# EAGLE design AudioMega v102 (EAGLE 6.2)
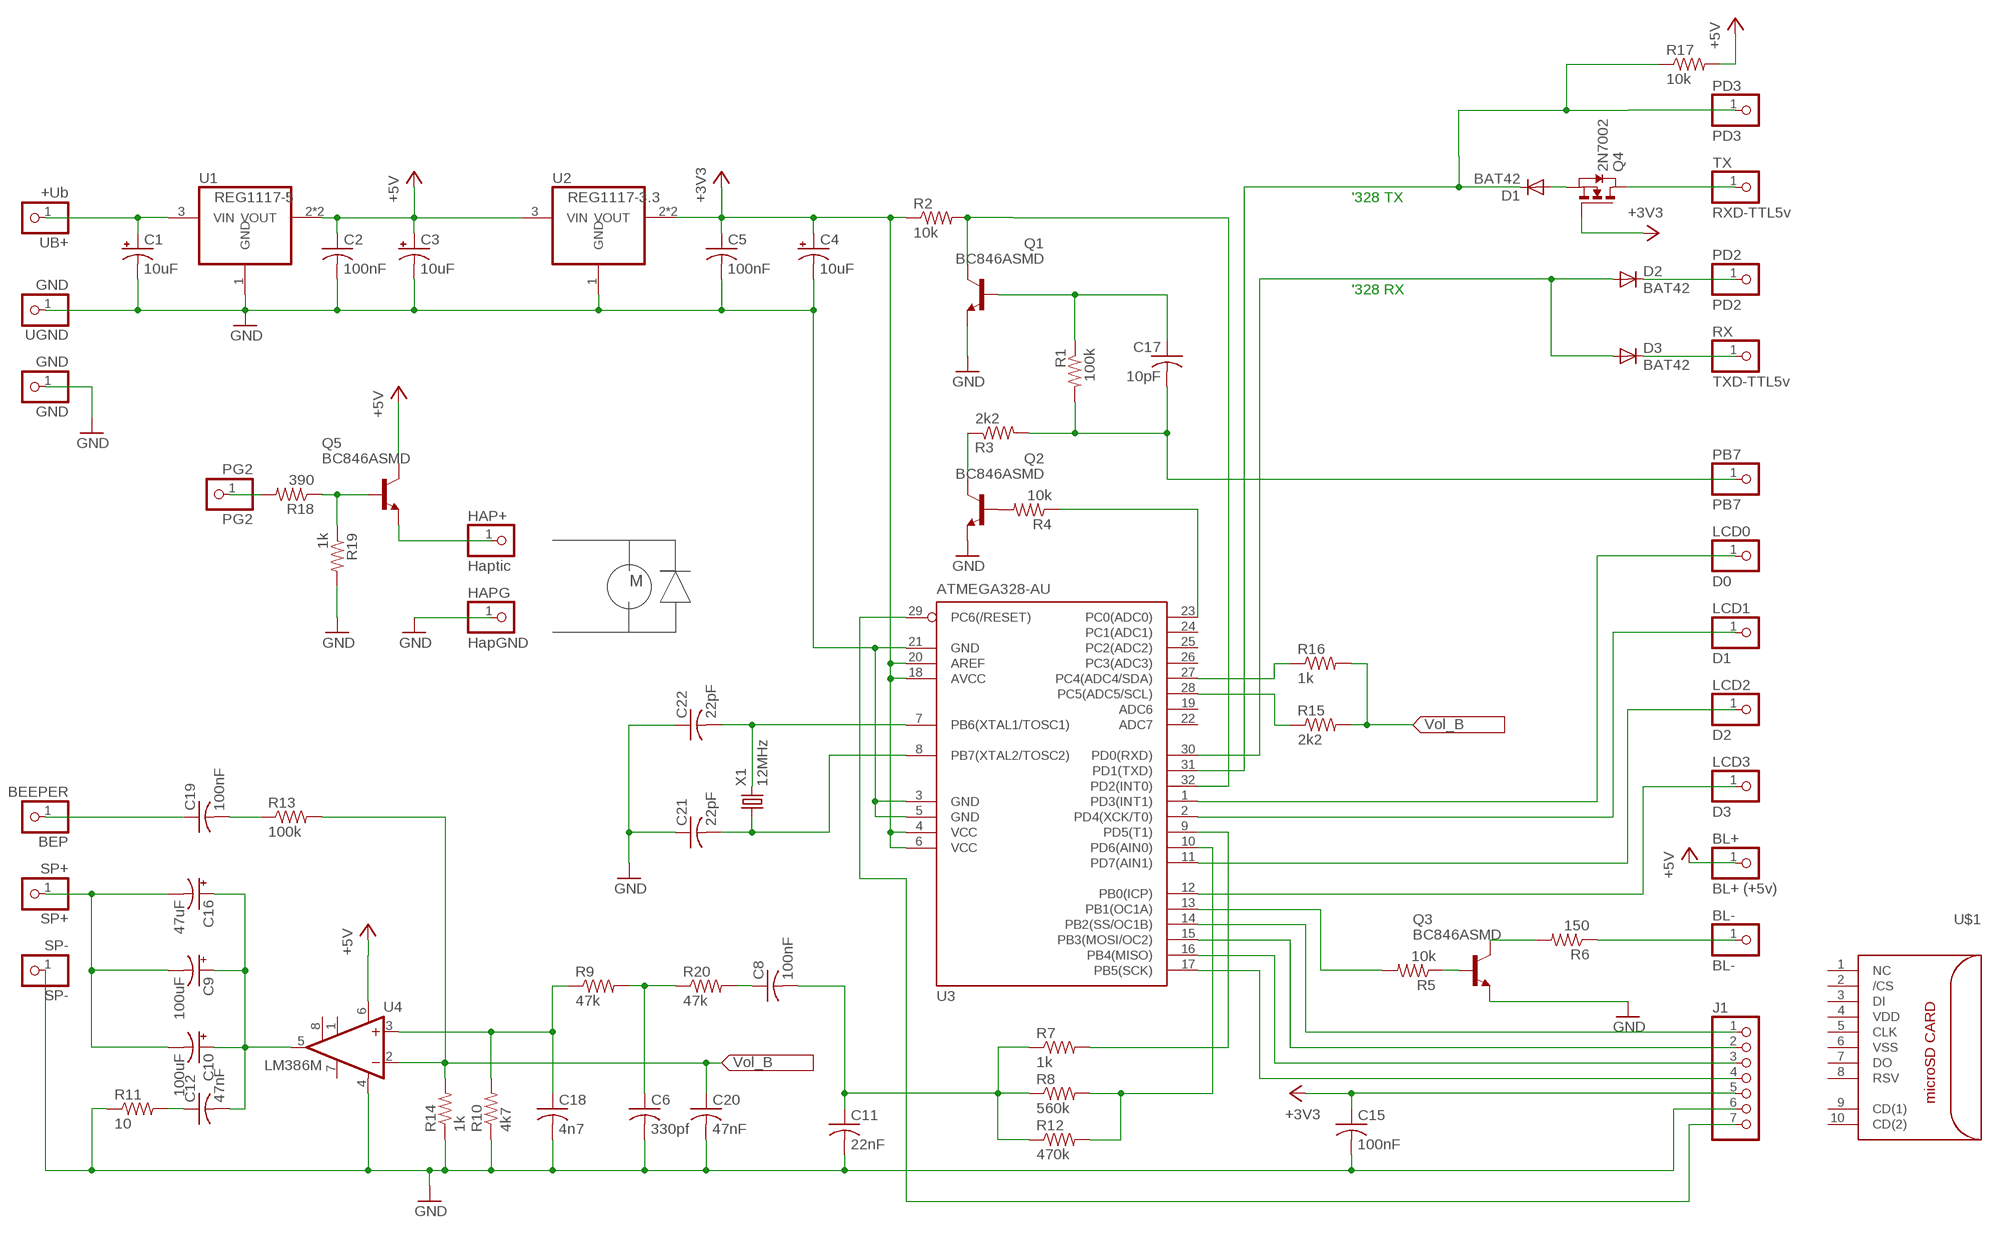
[diagram p0: schematic, sheet 1]

## Parts
BEP  BEEPER  PINHD-1X1  [1X01]
BL+  BL+ (+5v)  PINHD-1X1  [1X01]
BL-  BL-  PINHD-1X1  [1X01]
C1  10uF  CPOL-USCT3528  [CT3528]
C2  100nF  C-USC1206  [C1206]
C3  10uF  CPOL-USCT3528  [CT3528]
C4  10uF  CPOL-USCT3528  [CT3528]
C5  100nF  C-USC1206  [C1206]
C6  330pf  C-USC1206  [C1206]
C8  100nF  C-USC1206  [C1206]
C9  100uF  CPOL-USCT6032  [CT6032]
C10  100uF  CPOL-USCT6032  [CT6032]
C11  22nF  C-USC1206  [C1206]
C12  47nF  C-USC1206  [C1206]
C15  100nF  C-USC1206  [C1206]
C16  47uF  CPOL-USCT6032  [CT6032]
C17  10pF  C-USC1206  [C1206]
C18  4n7  C-USC1206  [C1206]
C19  100nF  C-USC1206  [C1206]
C20  47nF  C-USC1206  [C1206]
C21  22pF  C-USC1206  [C1206]
C22  22pF  C-USC1206  [C1206]
D1  BAT42  DIODE-SOD123  [SOD123]
D2  BAT42  DIODE-SOD123  [SOD123]
D3  BAT42  DIODE-SOD123  [SOD123]
GND  GND  PINHD-1X1  [1X01]
HAP+  Haptic  PINHD-1X1  [1X01]
HAPG  HapGND  PINHD-1X1  [1X01]
J1  PINHD-1X7  [1X07]
LCD0  D0  PINHD-1X1  [1X01]
LCD1  D1  PINHD-1X1  [1X01]
LCD2  D2  PINHD-1X1  [1X01]
LCD3  D3  PINHD-1X1  [1X01]
PB7  PB7  PINHD-1X1  [1X01]
PD2  PD2  PINHD-1X1  [1X01]
PD3  PD3  PINHD-1X1  [1X01]
PG2  PG2  PINHD-1X1  [1X01]
Q1  BC846ASMD  [SOT23]
Q2  BC846ASMD  [SOT23]
Q3  BC846ASMD  [SOT23]
Q4  2N7002  NMOSSOT23  [SOT-23]
Q5  BC846ASMD  [SOT23]
R1  100k  R-US_R1206  [R1206]
R2  10k  R-US_R1206  [R1206]
R3  2k2  R-US_R1206  [R1206]
R4  10k  R-US_R1206  [R1206]
R5  10k  R-US_R1206  [R1206]
R6  150  R-US_R1206  [R1206]
R7  1k  R-US_R1206  [R1206]
R8  560k  R-US_R1206  [R1206]
R9  47k  R-US_R1206  [R1206]
R10  4k7  R-US_R1206  [R1206]
R11  10  R-US_R1206  [R1206]
R12  470k  R-US_R1206  [R1206]
R13  100k  R-US_R1206  [R1206]
R14  1k  R-US_R1206  [R1206]
R15  2k2  R-US_R1206  [R1206]
R16  1k  R-US_R1206  [R1206]
R17  10k  R-US_R1206  [R1206]
R18  390  R-US_R1206  [R1206]
R19  1k  R-US_R1206  [R1206]
R20  47k  R-US_R1206  [R1206]
RX  TXD-TTL5v  PINHD-1X1  [1X01]
SP+  SP+  PINHD-1X1  [1X01]
SP-  SP-  PINHD-1X1  [1X01]
TX  RXD-TTL5v  PINHD-1X1  [1X01]
U1  REG1117-5  REG1117  [SOT223]
U2  REG1117-3.3  REG1117  [SOT223]
U3  ATMEGA328-AU  MEGA8-AI  [TQFP32-08]
U4  LM386M  LM386M-1  [SO08]
U$1  MICROSD_SPI_MODE  [MICRO_SD_CONNECTOR]
UB+  +Ub  PINHD-1X1  [1X01]
UGND  GND  PINHD-1X1  [1X01]
X1  12MHz  CRYSTALHC49UP  [HC49UP]

## Nets
+5V: BL+.1 C2.1 C3.+ Q5.3(C) R17.2 U1.2(VOUT) U1.4(VOUT) U2.3(VIN) U4.6(VS)
B7: C17.2 PB7.1 R1.2 R3.2
CLK: Q1.3(C) R2.2 U3.32(PD2(INT0))
GND: C1.- C2.2 C3.- C4.- C5.2 C6.2 C11.2 C15.2 C18.2 C20.2 C21.1 C22.1 GND.1 HAPG.1 J1.6 Q1.2(E) Q2.2(E) Q3.2(E) R10.1 R11.1 R14.1 R19.2 SP-.1 U1.1(GND) U2.1(GND) U3.3(GND) U3.5(GND) U3.21(GND) U4.4(GND) UGND.1
N$1: R4.1 U3.23(PC0(ADC0))
N$2: HAP+.1 Q5.2(E)
N$3: J1.2 U3.15(PB3(MOSI/OC2))
N$4: J1.3 U3.16(PB4(MISO))
N$6: J1.7 U3.29(PC6(/RESET))
N$7: C22.2 U3.7(PB6(XTAL1/TOSC1)) X1.2
N$8: C21.2 U3.8(PB7(XTAL2/TOSC2)) X1.1
N$9: Q2.1(B) R4.2
N$10: R16.1 U3.27(PC4(ADC4/SDA))
N$11: R15.1 U3.28(PC5(ADC5/SCL))
N$12: Q2.3(C) R3.1
N$13: C17.1 Q1.1(B) R1.1
N$15: C9.- C10.- C16.- SP+.1
N$16: C12.1 R11.2
N$17: C9.+ C10.+ C12.2 C16.+ U4.5(OUT)
N$18: C18.1 R9.1 R10.2 U4.3(+IN)
N$19: BEP.1 C19.1
N$20: C19.2 R13.1
N$21: J1.1 U3.14(PB2(SS/OC1B))
N$24: C6.1 R9.2 R20.1
N$25: C8.2 C11.1 R7.1 R8.1 R12.1
N$26: Q3.3(C) R6.2
N$27: R7.2 U3.9(PD5(T1))
N$28: R8.2 R12.2 U3.10(PD6(AIN0))
N$29: BL-.1 R6.1
N$30: LCD3.1 U3.12(PB0(ICP))
N$31: LCD2.1 U3.11(PD7(AIN1))
N$32: C1.+ U1.3(VIN) UB+.1
N$33: Q3.1(B) R5.1
N$34: R5.2 U3.13(PB1(OC1A))
N$35: LCD1.1 U3.2(PD4(XCK/T0))
N$36: LCD0.1 U3.1(PD3(INT1))
N$37: D3.C RX.1
N$38: D1.C PD3.1 R17.1 U3.31(PD1(TXD))
N$39: D2.C PD2.1
N$40: PG2.1 R18.2
N$41: Q4.1(D) TX.1
N$42: D2.A D3.A U3.30(PD0(RXD))
N$43: Q5.1(B) R18.1 R19.1
N$45: D1.A Q4.2(S)
N$57: J1.4 U3.17(PB5(SCK))
N$58: C4.+ C5.1 C15.1 J1.5 Q4.3(G) R2.1 U2.2(VOUT) U2.4(VOUT) U3.4(VCC) U3.6(VCC) U3.18(AVCC) U3.20(AREF) ; supply symbol labelled +3V3
N$61: C8.1 R20.2
VOL_B: C20.1 R13.2 R14.2 R15.2 R16.2 U4.2(-IN)
Unconnected: U3.19(ADC6) U3.22(ADC7) U3.24(PC1(ADC1)) U3.25(PC2(ADC2)) U3.26(PC3(ADC3)) U4.1(GAIN) U4.7(BYPASS) U4.8(GAIN) U$1.1(NC) U$1.2(/CS) U$1.3(DI) U$1.4(VDD) U$1.5(CLK) U$1.6(VSS) U$1.7(DO) U$1.8(RSV) U$1.9(CD(1)) U$1.10(CD(2))

## Notes on the sheet
- '328 TX
- '328 RX
- M

## Library data of the parts
BEP BL+ BL- GND HAP+ HAPG LCD0 LCD1-LCD3 PB7 PD2 PD3 PG2 RX SP+ SP- TX UB+ UGND = pinhead:PINHD-1X1: PIN HEADER
C1 C3 C4 C9 C10 C16 = resistor:CPOL-US: POLARIZED CAPACITOR, American symbol
C2 C5 C6 C8 C11 C12 C15 C17-C22 = resistor:C-US: CAPACITOR, American symbol
D1-D3 = diode:DIODE-: DIODE
J1 = pinhead:PINHD-1X7: PIN HEADER
Q1-Q3 Q5 = transistor-npn:BC846*: NPN Transistor
Q4 = zetex:NMOSSOT23: MOS FET; OC_FARNELL: unknown; OC_NEWARK: unknown
R1-R20 = resistor:R-US_: RESISTOR, American symbol
U1 U2 = burr-brown:REG1117: 800mA and 1A Low Dropout (LDO) Positive Regulator 1.8V, 2.5V, 2.85V, 3.3V, 5V, and Adj; MPN: REG1117; OC_FARNELL: 1097566; OC_NEWARK: 14P6981
U3 = atmel:MEGA8: MICROCONTROLLER 8 Kbytes FLASH, 1 kbytes SRAM, 512 bytes EEPROM, USART, 6-channel 10 bit ADC, 2-channel 8 bit ADC Pin compatible with Atmega48, ATMega88, ATMega168 Source: avr.lbr; MPN: ATMEGA8-16AU; OC_FARNELL: 9171371; OC_NEWARK: 73M8863
U4 = linear:LM386?-*: Low Voltage Audio Power Amplifier Source: http://cache.national.com/ds/LM/LM386.pdf
U$1 = con-molex-microsd:MICROSD_SPI_MODE: MOLEX - 49225-0821 - CONNECTEUR MICRO SD PUSH/PUSH REV Fabricant: MOLEX Code commande Farnell: 1366700 <http://fr.farnell.com/molex/49225-0821/connecteur-micro-sd-push-push-rev/dp/1366700?Ntt=1366700> Référence fabricant: 49225-0821
X1 = crystal:CRYSTAL: CRYSTAL; OC_FARNELL: unknown; OC_NEWARK: unknown

## Board
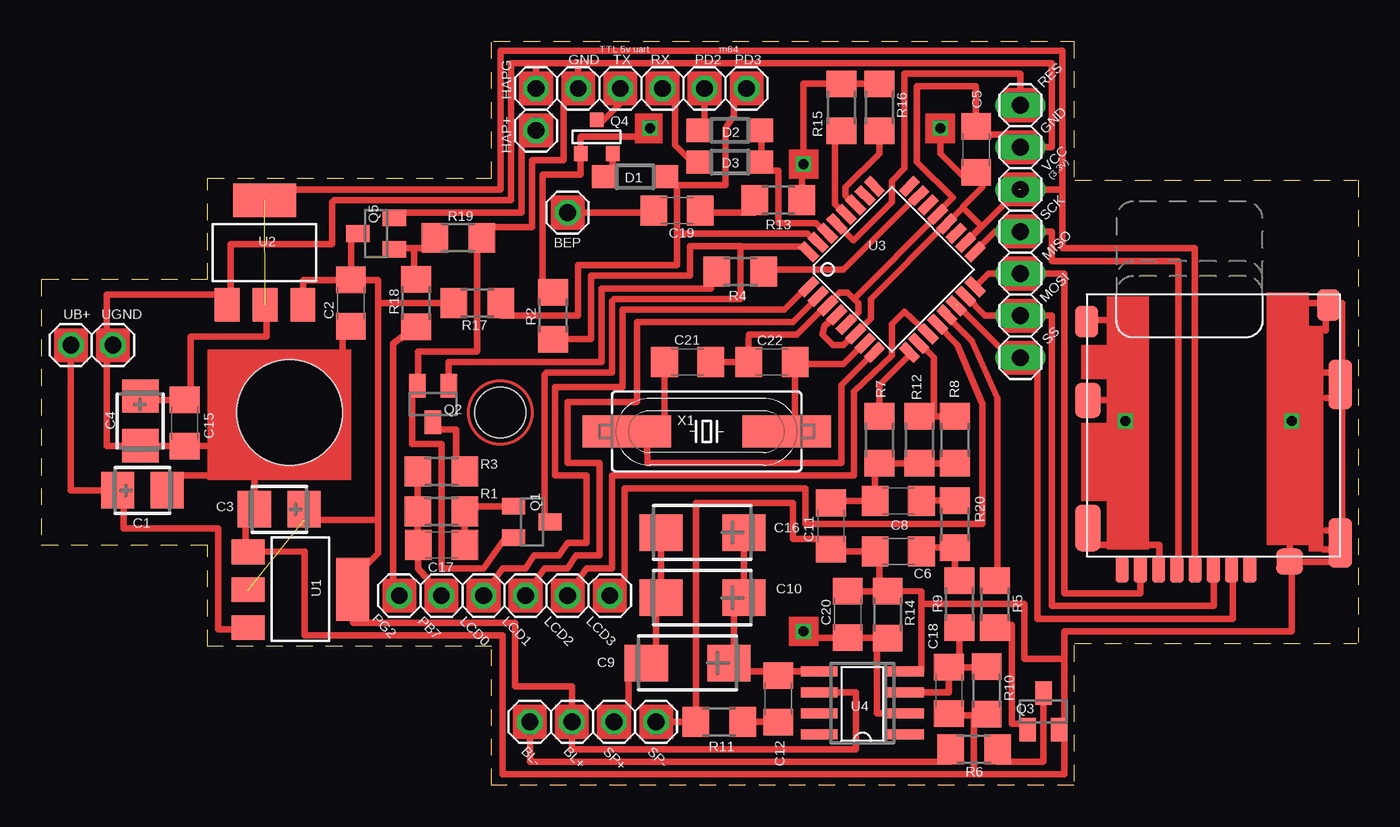
[diagram p1: board, top side]
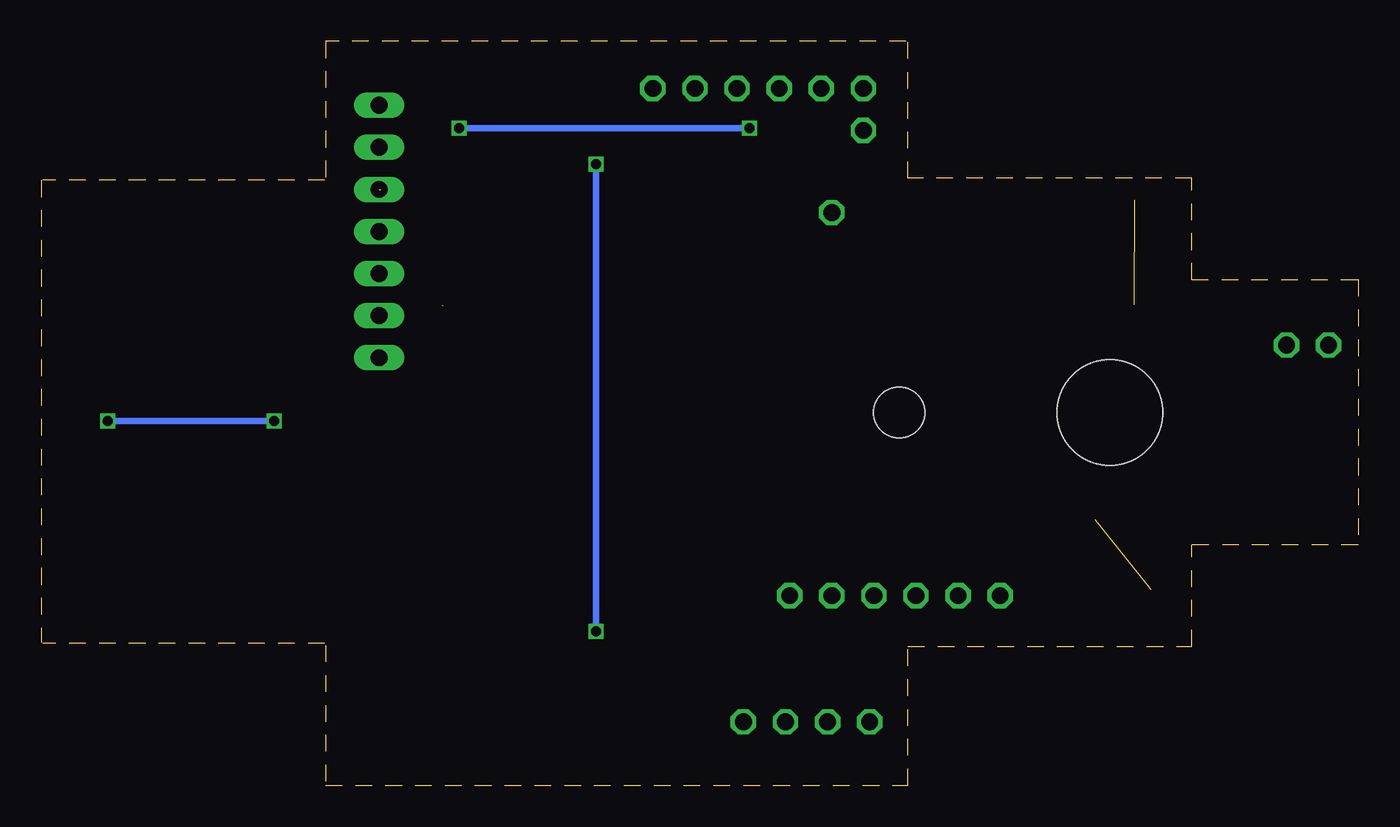
[diagram p2: board, bottom side, seen from below]

Size 79.43 x 44.89 mm. Coordinates in mm from the lower left corner, seen from the top.
Outline: 27.29,44.89 62.29,44.89 62.29,36.45
Outline: 27.16,44.83 27.16,36.64 10.03,36.64 10.03,30.51 0,30.51 0,14.51 10.03,14.51 10.03,8.38 27.16,8.38 27.16,0 62.29,0 62.29,8.44
Outline: 79.43,36.51 79.43,8.64
Outline: 62.36,8.57 79.36,8.57
Outline: 62.36,36.51 79.36,36.51
Copper layers (1*16): Top 0.035mm / dielectric 1.5mm / Bottom 0.035mm
Design rules: minimum track width 6mil, minimum drill 12mil, track to track 6mil, track to pad 6mil, pad to pad 6mil, via to via 6mil, smd to smd 0mil, copper to edge 10mil, drill to drill 10mil, minimum pad ring 10mil, minimum via ring 6mil, stop-mask expansion 2mil, vias tented up to drill 100mil, thermal gap 10mil
Holes 6.35 mm at 14.99,22.5
Holes 3.05 mm at 27.69,22.5

### Footprints (pad centres in the part's own frame; a part is rotated, then mirrored left to right if it is on the bottom)
1X01 = drill 1.016 octagon: 1 0,0
CT3528 = smd 2 x 2.2: + 1.5,0; - -1.5,0
C1206 = smd 1.6 x 1.8: 1 -1.4,0; 2 1.4,0
CT6032 = smd 2.6 x 2.2: + 2.5,0; - -2.5,0
SOD123 = smd 1.4 x 1.4: A 1.9,0; C -1.9,0
1X07 = drill 1.016 long: 1 -7.62,0; 2 -5.08,0; 3 -2.54,0; 4 0,0; 5 2.54,0; 6 5.08,0; 7 7.62,0
SOT23 = smd 1 x 1.4: 1 -0.95,-1.1; 2 0.95,-1.1; 3 0,1.1
SOT-23 = smd 0.787 x 0.889: 1 0.025,-1.016; 2 -0.94,1.016; 3 0.991,1.016
R1206 = smd 1.6 x 1.803: 1 -1.422,0; 2 1.422,0
SOT223 = smd 1.499 x 2.007: 1 -2.261,-3.15; 2 0.025,-3.15; 3 2.311,-3.15 | smd 3.81 x 2.007: 4 0,3.15
TQFP32-08 = smd 1.27 x 0.559: 1 -4.293,2.8; 2 -4.293,2; 3 -4.293,1.2; 4 -4.293,0.4; 5 -4.293,-0.4; 6 -4.293,-1.2; 7 -4.293,-2; 8 -4.293,-2.8; 17 4.293,-2.8; 18 4.293,-2; 19 4.293,-1.2; 20 4.293,-0.4; 21 4.293,0.4; 22 4.293,1.2; 23 4.293,2; 24 4.293,2.8 | smd 0.559 x 1.27: 9 -2.8,-4.293; 10 -2,-4.293; 11 -1.2,-4.293; 12 -0.4,-4.293; 13 0.4,-4.293; 14 1.2,-4.293; 15 2,-4.293; 16 2.8,-4.293; 25 2.8,4.293; 26 2,4.293; 27 1.2,4.293; 28 0.4,4.293; 29 -0.4,4.293; 30 -1.2,4.293; 31 -2,4.293; 32 -2.8,4.293
SO08 = smd 0.6 x 2.2: 1 -1.905,-2.6; 2 -0.635,-2.6; 3 0.635,-2.6; 4 1.905,-2.6; 5 1.905,2.6; 6 0.635,2.6; 7 -0.635,2.6; 8 -1.905,2.6
MICRO_SD_CONNECTOR = smd 0.8 x 1.6: 1 -2.03,8.2; 2 -0.93,8.2; 3 0.17,8.2; 4 1.27,8.2; 5 2.37,8.2; 6 3.47,8.2; 7 4.57,8.2; 8 5.67,8.2 | smd 1.55 x 2.8: 9 7.735,5.7 | smd 1.55 x 2.1: 10 7.735,-2 | smd 1.4 x 1.9: 11 7.81,-6.75; 12 -6.79,-7.75 | smd 1.4 x 3: 13 -7.49,-2.95; 14 -7.49,6.6 | smd 1.6 x 1.55: 15 -4.43,7.725
HC49UP = smd 5.334 x 1.93: 1 -4.826,0; 2 4.826,0

### Placement (x,y rotation side)
BEP  31.75,34.56 0 top
BL+  32,3.83 0 top
BL-  29.46,3.83 0 top
C1  6.1,17.8 180 top
C2  18.67,29.1 270 top
C3  14.35,16.65 0 top
C4  5.97,21.99 90 top
C5  56.39,38.37 90 top
C6  51.69,14.11 180 top
C8  51.69,17.16 180 top
C9  38.99,7.38 0 top
C10  39.88,11.32 0 top
C11  47.62,15.64 270 top
C12  44.45,5.22 90 top
C15  8.64,21.86 270 top
C16  39.88,15.26 0 top
C17  24.13,14.5 180 top
C18  54.74,5.73 270 top
C19  38.35,34.69 0 top
C20  48.64,10.3 90 top
C21  38.99,25.54 180 top
C22  44.07,25.54 0 top
D1  35.81,36.72 180 top
D2  41.53,39.52 0 top
D3  41.53,37.61 0 top
GND  32.38,42.05 0 top
HAP+  29.84,39.52 0 top
HAPG  29.84,42.05 0 top
J1  59.06,33.42 90 top
LCD0  26.67,11.45 0 top
LCD1  29.21,11.45 0 top
LCD2  31.75,11.45 0 top
LCD3  34.29,11.45 0 top
PB7  24.13,11.45 0 top
PD2  40.01,42.05 0 top
PD3  42.55,42.05 0 top
PG2  21.59,11.45 0 top
Q1  29.59,15.89 270 top
Q2  23.62,23 180 top
Q3  60.45,4.46 0 top
Q4  33.53,39.13 180 top
Q5  20.19,33.29 90 top
R1  24.13,16.53 180 top
R2  30.86,28.34 270 top
R3  24.13,18.94 180 top
R4  42.16,31.01 180 top
R5  57.53,10.94 90 top
R6  56.26,2.18 0 top
R7  50.55,20.85 90 top
R8  55.12,20.85 90 top
R9  55.37,10.94 90 top
R10  57.02,5.73 90 top
R11  40.89,3.83 0 top
R12  52.96,20.85 90 top
R13  44.45,35.32 0 top
R14  51.05,10.3 270 top
R15  48.26,40.91 90 top
R16  50.55,40.91 90 top
R17  26.29,29.1 180 top
R18  22.61,29.1 270 top
R19  25.15,33.04 0 top
R20  55.12,15.77 90 top
RX  37.47,42.05 0 top
SP+  34.54,3.83 0 top
SP-  37.08,3.83 0 top
TX  34.93,42.05 0 top
U1  15.62,11.83 270 top
U2  13.46,32.15 0 top
U3  51.31,31.13 45 top
U4  49.53,4.97 90 top
U$1  70.87,21.23 180 top
UB+  1.78,26.56 0 top
UGND  4.32,26.56 0 top
X1  40.13,21.35 0 top

### Tracks (layer width: path | path; a pad name or v marks a point on that pad's centre or on a via)
+5V  (1 unrouted)
  Top 0.406: U4.6 49.15,5.61 49.15,2.18 32,2.18 BL+.1 32,5.99 28.58,5.99 28.58,9.8 21.46,9.8 18.8,9.8 U1.4 | 15.75,29.74 U2.3 | U1.4 18.41,12.08 20.32,13.99 20.32,15.13 20.32,16.02 | U1.4 18.29,11.83 | 18.29,11.83 18.29,11.96 | U1.4 18.29,11.83 | 15.87,28.9 U2.3 | 20.32,16.02 20.32,27.83 20.32,29.1 | C3.+ 15.85,16.02 16,16.02 19.43,16.02 20.32,16.02 | 15.88,29.1 15.77,28.21 U2.3 | 19.43,33.29 19.47,33.29 Q5.3 18.8,33.29 18.67,33.16 18.67,31.14 C2.1 | 20.32,29.1 R17.2 | C2.1 20.32,30.5 20.32,29.1 | C2.1 15.77,30.5 U2.3
B7
  Top 0.406: R3.2 22.71,19.19 R1.2 22.71,15.91 C17.2 22.73,13.1 PB7.1
CLK
  Top 0.406: 42.16,32.5 45.98,32.5 U3.32 | Q1.3 30.35,15.89 30.35,23.77 | 30.35,23.77 30.35,24.27 | 42.16,32.5 42.16,29.36 34.54,29.36 34.42,29.23 34.42,24.91 30.48,24.91 30.35,24.78 30.35,23.77 | R2.2 33.15,26.92 33.15,30.5 33.15,30.75 39.12,30.75 39.12,32.53 42.16,32.53 42.16,32.5
GND
  Top 0.254: 18.16,26.05 10.79,26.05
  Top 0.406: U1.1 12.47,13.96 | 10.79,18.69 10.79,18.66 | 10.79,18.66 10.79,18.69 | 10.79,18.69 10.79,19.58 | 10.79,19.58 10.79,26.05 | 11.43,29.61 3.94,29.61 3.94,26.56 | 11.43,29.61 U2.1 | 10.79,19.58 10.79,20.46 C15.2 8.51,20.72 8.41,20.49 C4.- 3.94,20.49 3.94,26.56 | 10.79,19.58 10.79,18.69 | 10.79,18.69 10.79,18.66 | 10.79,18.66 10.79,18.69 | 32.38,43.58 60.96,43.58 60.96,38.5 J1.6 59.06,39.26 56.13,39.26 C5.2 56.39,42.18 52.83,42.18 52.83,37.61 54.99,35.45 54.06,34.52 U3.21 54.06,34.39 49.02,29.36 | SP-.1 R11.1 39.5,3.83 39.5,17.04 45.34,17.04 45.34,14.88 48.26,14.88 C11.2 47.5,14.11 C6.2 50.55,14.11 50.55,11.7 50.29,11.7 C20.2 51.41,11.7 R14.1 53.09,11.7 53.09,10.94 | C18.2 54.74,4.21 56.9,4.21 56.9,4.31 R10.1 57,4.34 56.26,4.34 56.26,0.65 | C21.1 C22.1 42.67,26.81 42.67,27.2 45.59,27.2 47.34,28.95 U3.3 47.42,29.03 48.13,29.74 48.64,29.74 49.02,29.36 | 49.02,29.36 49.28,29.1 49.28,28.54 U3.5 | 56.26,0.65 27.81,0.65 27.81,9.04 15.87,9.04 15.87,14.11 U1.1 | 56.26,0.65 61.72,0.65 61.72,2.94 | U4.4 53.09,6.88 53.09,10.94 | Q3.2 61.53,2.94 61.72,2.94 | 78.49,29.1 78.49,13.48 75.44,13.48 75.44,9.29 61.72,9.29 61.72,7.64 | 61.72,7.64 59.31,7.64 59.31,10.94 53.09,10.94 | 11.43,29.61 11.43,32.66 17.53,32.66 17.53,33.04 17.53,35.2 17.65,35.32 28.32,35.32 28.32,43.58 29.84,43.58 | Q1.2 28.07,14.75 27.94,14.88 26.67,13.1 24.13,13.1 24.13,20.59 22.35,20.59 22.35,24.04 Q2.2 22.73,24.17 22.73,26.18 26.29,26.18 26.29,31.26 26.31,33.29 R19.2 26.67,33.57 27.18,33.67 29.59,33.67 29.59,37.74 31.5,37.74 31.5,41.17 GND.1 32.38,43.58 | C1.- 7.62,18.69 10.79,18.69 | U1.1 12.32,14.09 12.32,16.78 12.85,16.78 C3.- 12.85,18.66 10.79,18.66
  Top 0.406: C2.2 18.16,27.71 18.16,26.05 | 29.84,43.58 32.38,43.58 | HAPG.1 29.84,43.58 | UGND.1 3.94,26.56 | 61.72,2.94 61.72,7.64 | 10.79,18.66 10.79,18.69
N$1
  Top 0.406: U3.23 52.84,35.58 48.39,31.13 43.59,31.13 R4.1
N$2
  Top 0.406: HAP+.1 28.96,38.63 28.96,34.56 24.64,34.56 21.93,34.56 Q5.2
N$3
  Top 0.406: 70.7,10.81 60.96,10.81 60.96,28.34 60.71,28.34 J1.2 56.93,28.34 U3.15
N$4
  Top 0.406: 66.3,11.57 61.72,11.57 61.72,30.88 J1.3 57.12,30.88 U3.16
N$5
  Top 0.406: 70.74,10.81 70.74,12.97
N$6
  Top 0.406: U3.29 48.96,32.91 49.02,32.91 51.31,35.2 51.31,36.47 52.07,37.23 52.07,42.94 59.06,42.94 J1.7
N$7
  Top 0.406: U3.7 49.65,26.68 48.39,25.42 47.24,25.42 45.09,25.42 C22.2 45.47,21.36 X1.2 45.72,21.35 46.1,21.48
N$8
  Top 0.406: U3.8 50.23,26.12 48.77,24.66 48.26,24.15 48.26,22.88 48.26,21.23 48.26,19.45 36.58,19.45 36.51,21.4 | 36.51,21.4 X1.1 | C21.2 37.59,21.33 36.51,21.4
N$9
  Top 0.406: R4.2 40.81,30.31 40.39,30.31 40.39,29.99 33.78,29.99 33.78,25.54 24.57,25.54 Q2.1
N$10
  Top 0.406: U3.27 49.08,35.02 48.51,35.58 48.51,36.09 50.55,38.12 R16.1
N$11
  Top 0.406: U3.28 48.5,34.45 47.88,35.07 47.88,38.98 R15.1
N$12
  Top 0.406: R3.1 25.55,19.04 25.15,19.45 25.02,19.45 25.02,21.48 23.62,21.48 Q2.3
N$13
  Top 0.406: Q1.1 25.55,16.84 R1.1 25.53,16.53 C17.1
N$14  (via drill 0.6)
  Bottom 0.406: v65.41,21.99 v75.44,21.99
N$15
  Top 0.406: C16.- C10.- 37.34,11.32 37.08,11.07 37.08,7.98 C9.- 36.83,7.38 35.43,7.38 35.43,4.72 SP+.1
N$16
  Top 0.406: R11.2 C12.1
N$17
  Top 0.406: C9.+ 41.49,7.26 41.11,6.88 42.04,6.88 | U4.5 43.56,6.88 | 43.56,6.88 42.04,6.88 | 42.76,15.26 C16.+ C10.+ 41.78,11.32 41.78,7.13 42.04,6.88 | C12.2 43.56,6.88
N$18
  Top 0.406: U4.3 54.74,5.61 C18.1 | C18.1 57.02,7.13 R10.2 | C18.1 54.99,7.13 54.99,7.51 55.37,7.51 55.37,7.38 R9.1
N$19
  Top 0.406: BEP.1 36.83,34.56 C19.1
N$20
  Top 0.406: R13.1 43.41,34.92 43.05,34.56 39.88,34.56 C19.2
N$21  (1 unrouted)
  Top 0.406: 55.25,28.97 58.42,25.8 J1.1 60.07,25.8 60.07,23.26 60.07,10.05 71.8,10.05
N$24
  Top 0.406: C6.1 53.22,14.34 R20.1 55.12,12.62 R9.2
N$25
  Top 0.406: R8.1 R12.1 R7.1 50.29,19.93 C8.2 48.13,17.16 C11.1
N$26
  Top 0.406: Q3.3 60.45,1.41 57.66,1.41 57.66,1.92 R6.2
N$27
  Top 0.406: U3.9 52.32,26.05 52.45,26.05 50.55,24.15 R7.2
N$28
  Top 0.406: U3.10 53.85,25.8 53.85,22.27 | R8.2 55.37,22.62 R8.2 | R8.2 53.85,22.27 | 53.85,22.27 R12.2
N$29
  Top 0.406: R6.1 54.84,1.41 29.59,1.41 29.46,1.41 BL-.1
N$30
  Top 0.406: U3.12 55.25,26.56 56.77,23 56.77,15.77 46.1,15.77 46.1,17.93 35.18,17.93 35.18,12.46 LCD3.1
N$31
  Top 0.406: U3.11 52.07,28.59 51.31,27.83 51.31,25.93 49.02,23.77 49.02,18.69 34.42,18.69 34.42,13.1 32.89,13.1 LCD2.1
N$32
  Top 0.406: UB+.1 1.78,26.05 1.78,17.8 C1.+ 4.95,18.18 4.95,15.51 10.67,15.51 10.67,9.42 12.47,9.42 U1.3
N$33
  Top 0.406: Q3.1 59.56,3.36 59.44,3.36 59.44,3.7 58.55,3.7 58.55,9.67 57.53,9.67 R5.1
N$34
  Top 0.406: U3.13 54.63,28.32 56.13,26.82 57.66,23.39 57.66,12.21 R5.2
N$35
  Top 0.406: LCD1.1 30.35,13.1 31.75,13.1 32.26,13.86 33.66,13.86 33.66,19.45 31.75,19.45 31.75,23.13 35.94,23.13 35.94,27.96 45.34,27.96 46.86,29.48 U3.2
N$36
  Top 0.406: U3.1 46.19,30.08 44.83,28.72 35.05,28.72 35.05,24.02 30.99,24.02 30.99,18.69 32.89,18.69 32.89,14.62 31.75,14.62 31.24,13.86 29.72,13.86 29.21,13.1 27.81,13.1 LCD0.1
N$37
  Top 0.406: D3.C 39.12,37.74 38.23,38.63 38.23,41.29 RX.1
N$38
  Top 0.406: U3.31 46.77,32.75 46.23,33.29 40.01,33.29 38.35,33.29 | 38.35,33.29 38.35,31.39 32.38,31.39 32.38,28.34 27.71,28.34 R17.1 | 37.47,37.1 D1.C 37.47,37.1 | 37.47,37.1 37.94,36.56 | 37.94,36.56 38.35,36.09 | 38.35,36.09 38.35,33.29 | 37.47,37.1 37.94,36.56 | 37.94,36.56 38.35,36.09 | 37.94,36.56 38.29,36.21 41.27,36.21 41.27,39.64 41.78,40.4 41.78,41.29 PD3.1
N$39
  Top 0.406: PD2.1 40.01,39.64 D2.C
N$40
  Top 0.406: R18.2 21.21,26.66 21.21,21.73 21.21,11.83 PG2.1
N$41
  Top 0.406: Q4.1 33.91,40.15 34.93,41.17 TX.1
N$42
  Top 0.406: U3.30 47.34,33.32 46.74,33.93 44.45,33.93 44.45,37.1 43.3,37.1 D3.A 43.43,37.86 D2.A
N$43
  Top 0.406: R19.1 23.64,32.66 23.64,32.4 22.48,32.4 | R18.1 22.48,30.52 22.48,32.4 | 22.48,32.4 21.29,32.4 Q5.1
N$45
  Top 0.406: 33.86,37.03 D1.A 33.79,36.85 34.42,36.85 34.47,36.9 Q4.2
N$46
  Top 0.406: 76.2,29.1 78.49,29.1
N$47
  Top 0.406: 77.34,24.91 78.11,24.91
N$48
  Top 0.406: 77.47,23.39 77.85,23.39
N$49
  Top 0.406: 77.47,15.39 78.11,15.39
N$50
  Top 0.406: 77.34,14.24 78.11,14.24
N$51
  Top 0.406: 75.31,14.75 75.31,13.73
N$52
  Top 0.406: 77.47,28.21 77.47,27.45
N$53
  Top 0.406: 63.63,28.08 64.9,28.08 64.9,27.96
N$54
  Top 0.406: 63.5,23.26 64.9,23.26 64.9,23.13
N$55
  Top 0.406: 63.63,14.5 64.77,14.5
N$56
  Top 0.406: 66.29,11.57 66.29,13.1
N$57
  Top 0.406: 68.58,12.97 68.58,30.88 68.58,31.64 60.96,31.64 60.96,33.42 J1.4 57.53,33.42 56.32,32.21
  Top 0.61: U3.17 56.32,32.21
N$58  (via drill 0.6)  (2 unrouted)
  Top 0.406: 69.6,13.1 69.6,32.4 61.59,32.4 61.59,35.96 | 58.96,35.96 U3.18 | 55.76,32.79 56.77,33.8 56.64,33.8 55.63,34.82 | 55.63,34.82 55.56,34.82 U3.20 54.57,33.89 50.04,29.36 50.04,28.17 U3.6 48.39,26.56 47.75,26.56 47.12,27.2 47.24,27.7 U3.4 | C4.+ 5.62,23.26 C15.1 9.02,23.26 9.02,25.29 9.02,27.07 9.14,27.07 13.59,27.07 13.59,28.21 U2.2 | U2.4 14.22,35.96 27.66,35.96 27.69,35.96 27.69,44.34 33.91,44.34 61.59,44.34 61.59,35.96 | 55.63,34.82 55.63,34.94 56.77,36.09 56.77,36.59 56.77,36.85 C5.1 55.88,36.47 54.23,38.12 v54.23,39.64 | R2.1 30.23,30.27 30.23,36.85 32.38,36.85 32.51,36.85 32.51,39.13 | 32.51,39.13 36.7,39.13 v36.7,39.64 | 32.51,39.13 32.54,39.13 Q4.3 | 61.59,35.96 J1.5
  Top 0.61: U3.18 55.76,32.79
  Bottom 0.406: v36.7,39.64 v54.23,39.64
N$59
  Top 0.406: 71.88,12.84 71.88,10.05
N$60
  Top 0.406: 67.44,12.97 67.44,14.5 63.5,14.5 63.5,14.62
N$61
  Top 0.406: R20.2 53.22,17.19 C8.1
VOL_B  (via drill 0.6)
  Top 0.406: U4.2 50.42,4.34 50.42,8.91 | 50.42,8.91 C20.1 50.67,8.9 R14.2 | 50.04,8.91 50.42,8.91 | 50.42,8.91 46.23,8.91 v45.97,9.29 | R13.2 45.87,37.61 v45.97,37.48 45.97,40.15 45.97,42.33 R15.2 R16.2
  Bottom 0.406: v45.97,9.29 v45.97,37.48
(copper drawn outside any net)
  shapes: Top area x38, Top circle x1

### Text on the board
tPlace: TTL 5v uart | m64
tNames: RES | GND | VCC | (3.3v) | SCK | MISO | MOSI | SS
additional: Cut line